# Altium schematic sheet Main.SchDoc
size A; SheetNumber: 1; SheetTotal: 4
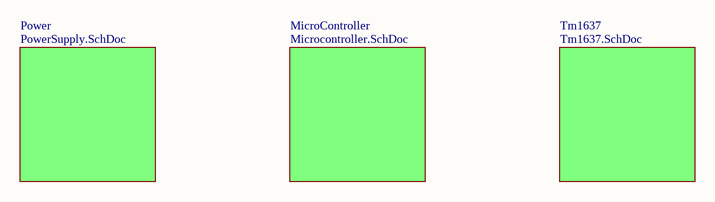
[diagram p0: Main.SchDoc]

## Sub-sheets
MicroController = Microcontroller.SchDoc: no entries
Power = PowerSupply.SchDoc: no entries
Tm1637 = Tm1637.SchDoc: no entries